# EasyEDA Pro project Project Hail Fally.epro

# Schematic Schematic1
Board Name: Board1; Create Date: 2026-05-25; Page Name: P1; Project Name: Project Hail Fally; Schematic Name: Schematic1; Update Date: 2026-05-28; Company: EasyEDA.com; Page Size: A4; Version: V1.0
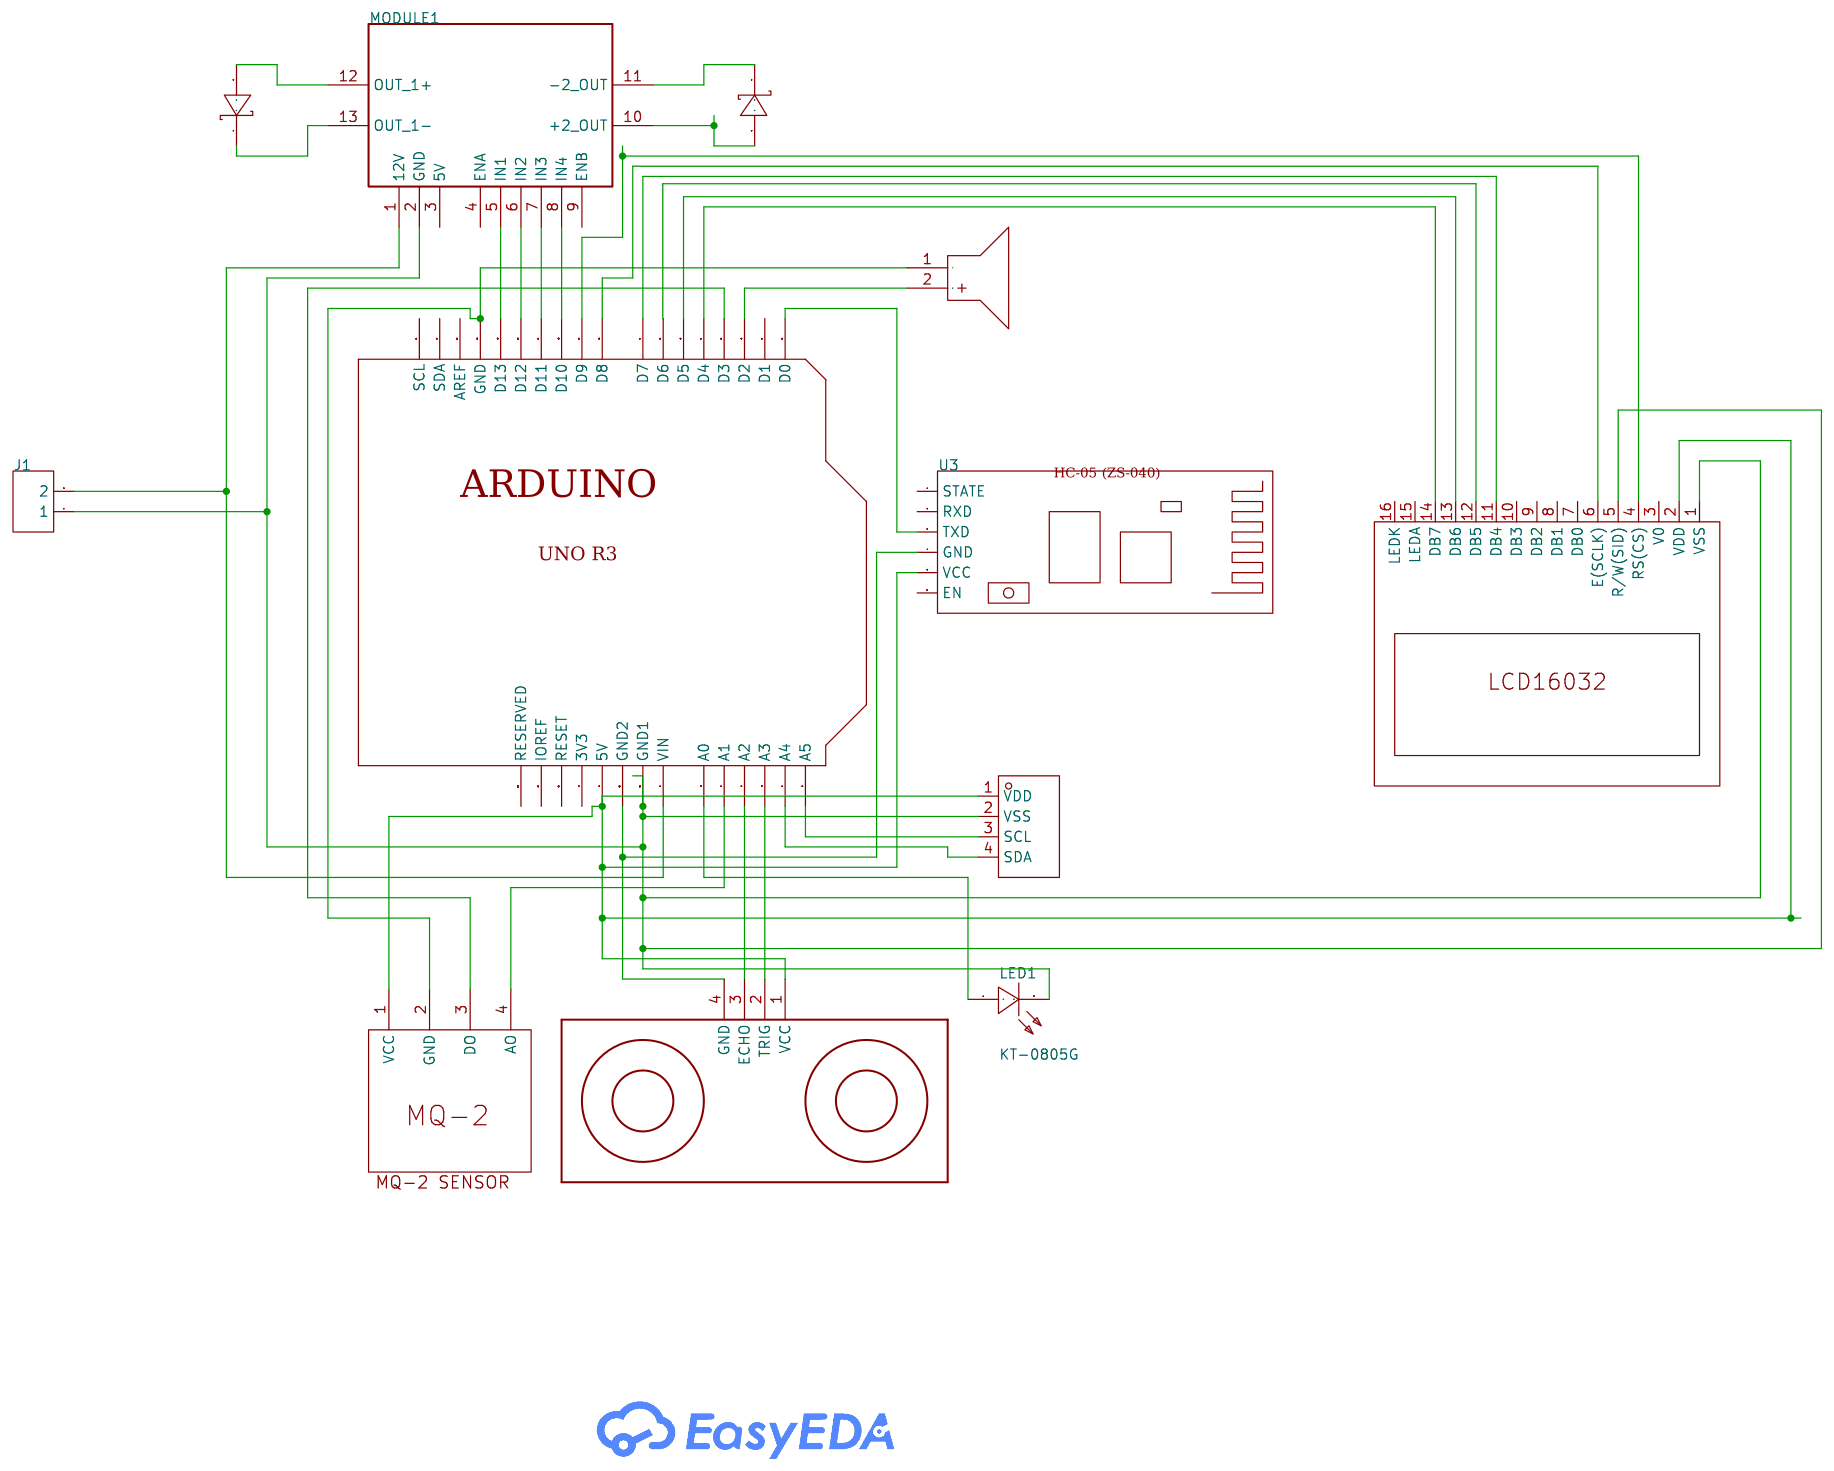
[diagram p0: schematic sheet]

## Parts
BUZZER1  buzzer  [BUZ-TH_BD12.0-P6.00-D0.9-RD]
D1  1N5819WS  [SOD-323_L1.8-W1.3-LS2.5-RD]
D2  1N5819WS  [SOD-323_L1.8-W1.3-LS2.5-RD]
J1  Bettery Connector  [HDR-M-2.54_1X2]
LED1  KT-0805G  [LED0805-R-RD]
MODULE1  L298N DUAL H-BRIDGE MOTOR DRIVER MODULE COPY1  [L298N DUAL H-BRIDGE MOTOR DRIVER MODULE footprint]
S1  Sensor_MQ-2_module_vertical_AIH  [SENSOR_MQ-2_MODULE_VERTICAL_AIH]
U1  SMR16032-ZD  [LCD-TH_SMR16032-ZD]
U2  weklin_ultrasonic_ULTRASONIC-HC-SR04_  [ULTRASONIC-HC-SR04]
U3  HC05-Bluetooth-Module_AK  [hc05-bluetooth-module_ak]
U4  HIH7121-021-001S  [SIP-4_L4.9-W1.9-P1.27-L]
U$1  Arduino Uno  [ARDUINO-R3]

## Library data of the parts
BUZZER1 = BUZZER: Supplier Part: C9900014030; JLCPCB Part Class: Extended Part; Supplier: LCSC
D1 D2 = 1N5819WS_C191023: Voltage - Forward(Vf@If):600mV@1A Voltage - DC Reverse(Vr):40V Current - Rectified:1A Non-Repetitive Peak Forward Surge Current:25A; LCSC Part Name: 电压:40V 电流:1A; Supplier Part: C191023; Manufacturer: Hottech(合科泰); Supplier Footprint: SOD-323; JLCPCB Part Class: Basic Part; Datasheet: https://item.szlcsc.com/datasheet/1N5819WS/213850.html; Supplier: LCSC; Voltage - Forward(Vf@If): 600mV@1A; Voltage - DC Reverse(Vr): 40V; Current - Rectified: 1A; Non-Repetitive Peak Forward Surge Current: 25A
J1 = Bettery Connector
LED1 = KT-0805G: Lamp Holder Type:2mm x 1.25mm square LED Illumination Color:Emerald Green Voltage - Forward(Vf):2.6V~3.1V Voltage - Forward(Vf):2.6V~3.1V Power(Watts):100mW Forward Current:5mA Wavelength - Dominant:513nm~528nm Wavelength - Dominant:513nm~528nm Peak Wavel; LCSC Part Name: 0805 翠绿 高亮; Supplier Part: C2297; Manufacturer: KENTO; Supplier Footprint: 0805; Datasheet: https://item.szlcsc.com/datasheet/KT-0805G/2670.html; Supplier: LCSC; Lamp Holder Type: 2mm x 1.25mm square LED; Illumination Color: Emerald Green; Voltage - Forward(Vf): 2.6V~3.1V; Power(Watts): 100mW; Forward Current: 5mA; Wavelength - Dominant: 513nm~528nm; Peak Wavelength: 525nm; Diode Configuration: Discrete Diode; Lens Color: Water Clear; Luminous Intensity: 430mcd; Viewing Angle: 120°; Operating Temperature: -40℃~+85℃
MODULE1 = L298N DUAL H-BRIDGE MOTOR DRIVER MODULE COPY1
S1 = MQ-2
U1 = SMR16032-ZD: Supplier Part: C9900249207; Supplier Footprint: LCD16032; Supplier: LCSC
U2 = weklin_ultrasonic_ULTRASONIC-HC-SR04_: LIB: weklin_ultrasonic; PRICE: 1,51; MANUFACTURER: Unknow; MPN: HC-SR04; OC_FARNELL: N.A.
U3 = HC05-Bluetooth-Module_AK: Modulo bluetooth
U4 = HIH7121-021-001S: Voltage - Supply:2.3V~5.5V Voltage - Supply:2.3V~5.5V; LCSC Part Name: 湿度：0%RH~100%RH; Supplier Part: C17346099; Manufacturer: Honeywell(霍尼韦尔); Supplier Footprint: SIP-4; Datasheet: https://item.szlcsc.com/datasheet/HIH7121-021-001S/18475263.html; Supplier: LCSC; Voltage - Supply: 2.3V~5.5V
U$1 = Arduino Uno

## Nets
$1N2570: J1.2 MODULE1.1(12V) U$1.VIN
$1N2633: MODULE1.5(IN1) U$1.D13
$1N2642: MODULE1.6(IN2) U$1.D12
$1N2654: MODULE1.7(IN3) U$1.D11
$1N2665: MODULE1.8(IN4) U$1.D10
$1N2669: D1.1(K) MODULE1.11(-2_OUT)
$1N2675: D1.2(A) MODULE1.10(+2_OUT)
$1N2684: D2.2(A) MODULE1.12(OUT_1+)
$1N2691: D2.1(K) MODULE1.13(OUT_1-)
$1N2827: U1.4(RS(CS)) U$1.D9
$1N2966: U1.13(DB6) U$1.D5
$1N2988: U1.14(DB7) U$1.D4
$1N2994: U2.2(TRIG) U$1.A3
$1N3109: U4.3(SCL) U$1.A5
$1N3118: U4.4(SDA) U$1.A4
$1N3220: BUZZER1.2(+) U$1.D2
$1N3505: U3.3(TXD) U$1.D0
$1N3594: U1.11(DB4) U$1.D7
$1N3613: U1.6(E(SCLK)) U$1.D8
$1N3669: U2.3(ECHO) U$1.A2
$1N4283: U2.4(GND) U3.4(GND) U$1.GND2
$1N4424: S1.1(VCC) U1.2(VDD) U2.1(VCC) U3.5(VCC) U4.1(VDD) U$1.5V
$1N4727: BUZZER1.1(-) S1.2(GND) U$1.GND
$1N4823: J1.1 LED1.2(K) MODULE1.2(GND) U1.1(VSS) U1.5(R/W(SID)) U4.2(VSS) U$1.GND1
$1N4998: S1.4(AO) U$1.A1
$1N5007: S1.3(DO) U$1.D3
$1N5154: LED1.1(A) U$1.A0

Not connected (* = marked no-connect by the designer): MODULE1 3(5V) 4(ENA) 9(ENB); U1 3(V0) 7(DB0) 8(DB1) 9(DB2) 10(DB3) 12(DB5) 15(LEDA) 16(LEDK); U3 1(STATE) 2(RXD) 6(EN); U$1 3V(3V3) AREF D1 D6 IOREF RESERVED RESET SCL SDA

# Board PCB1
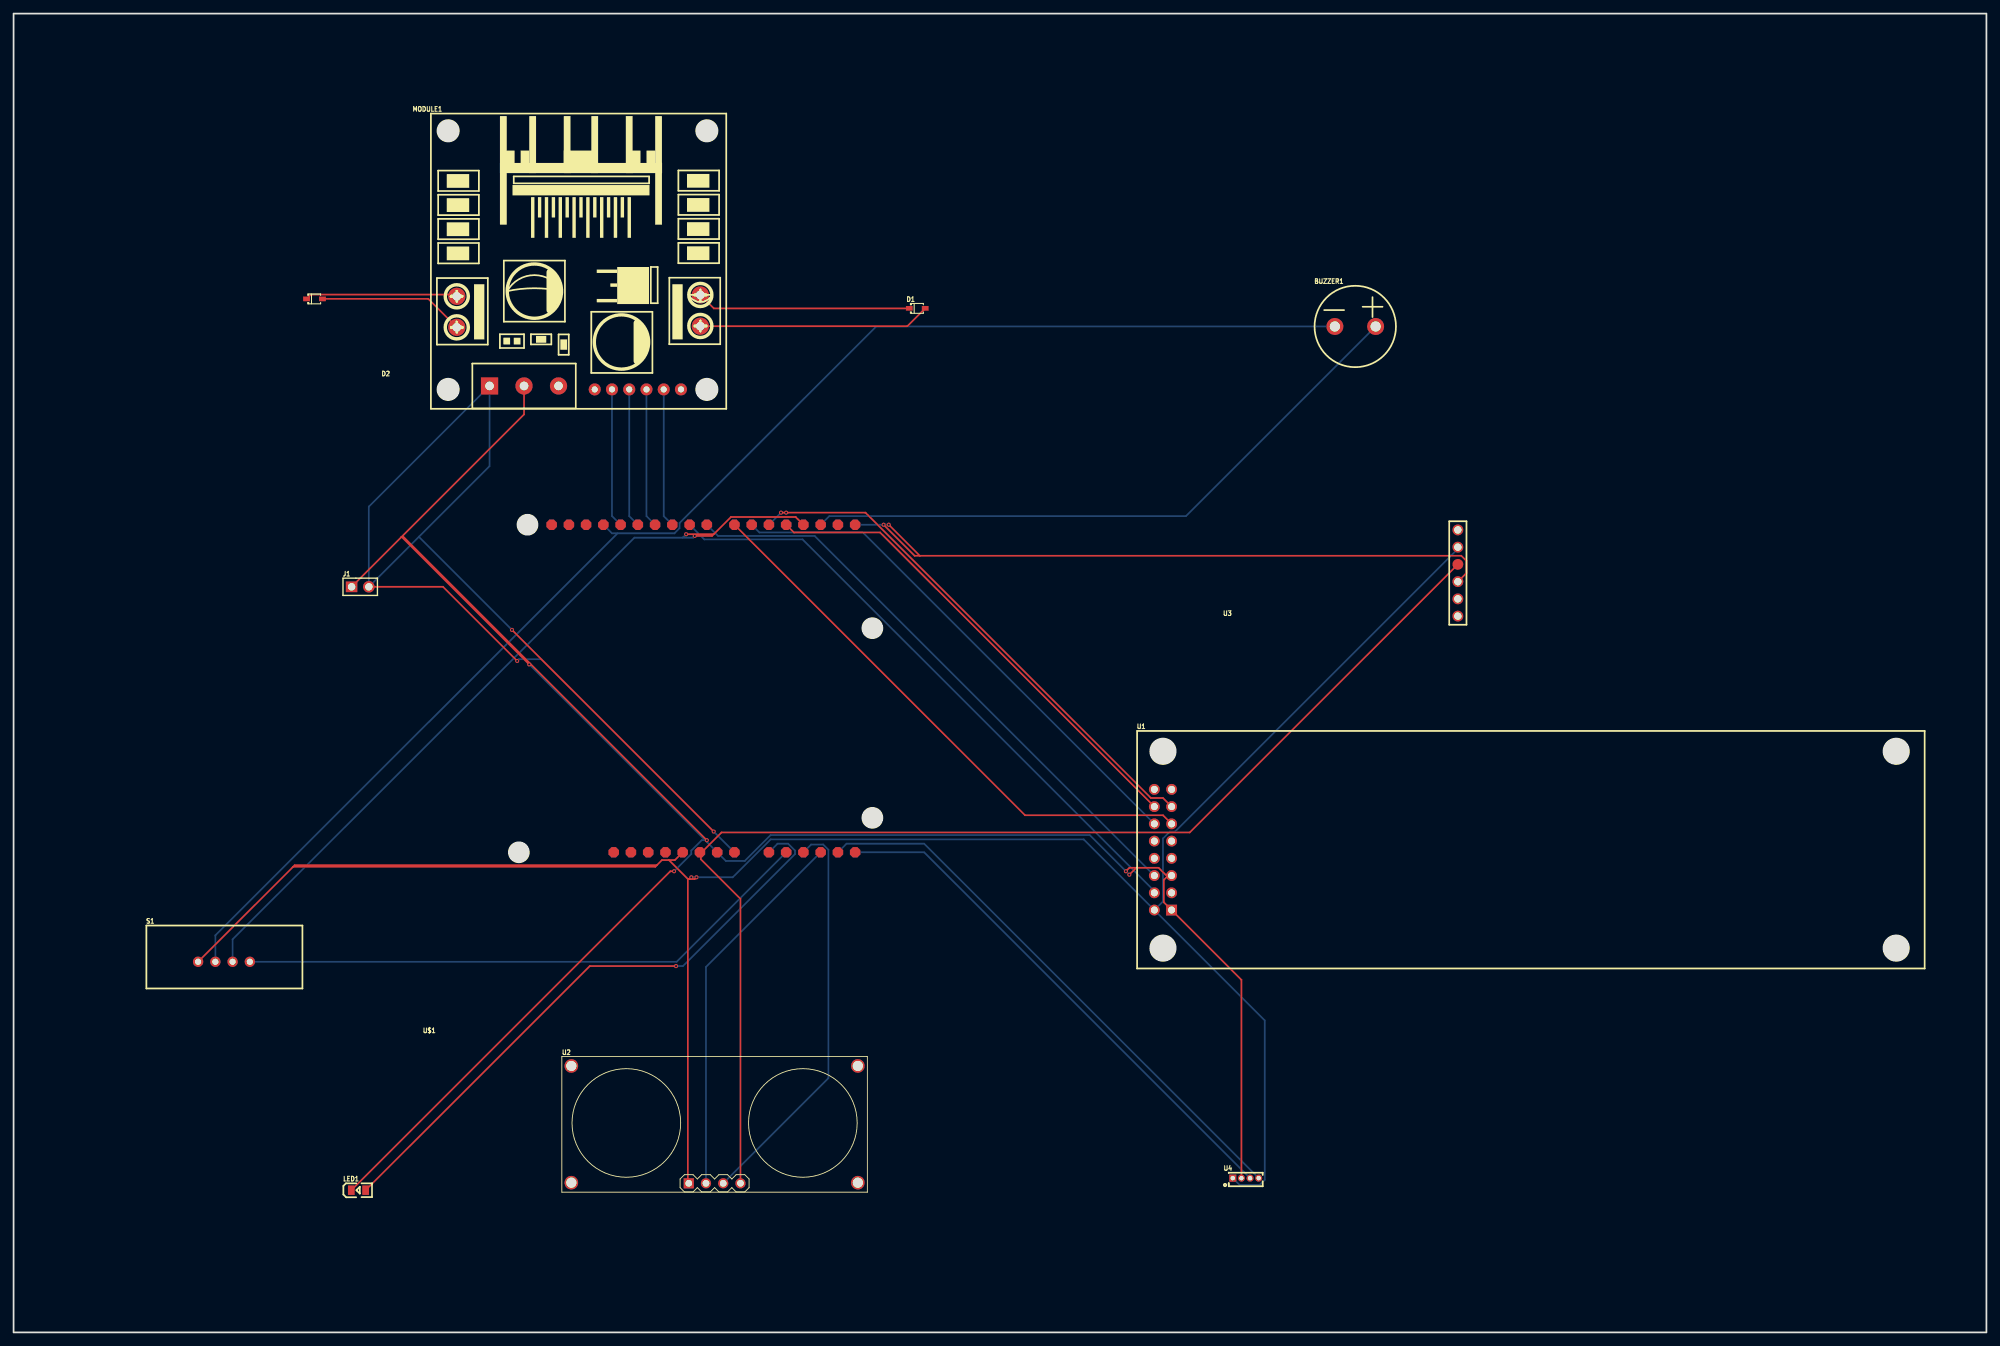
[diagram p1: board, top side]
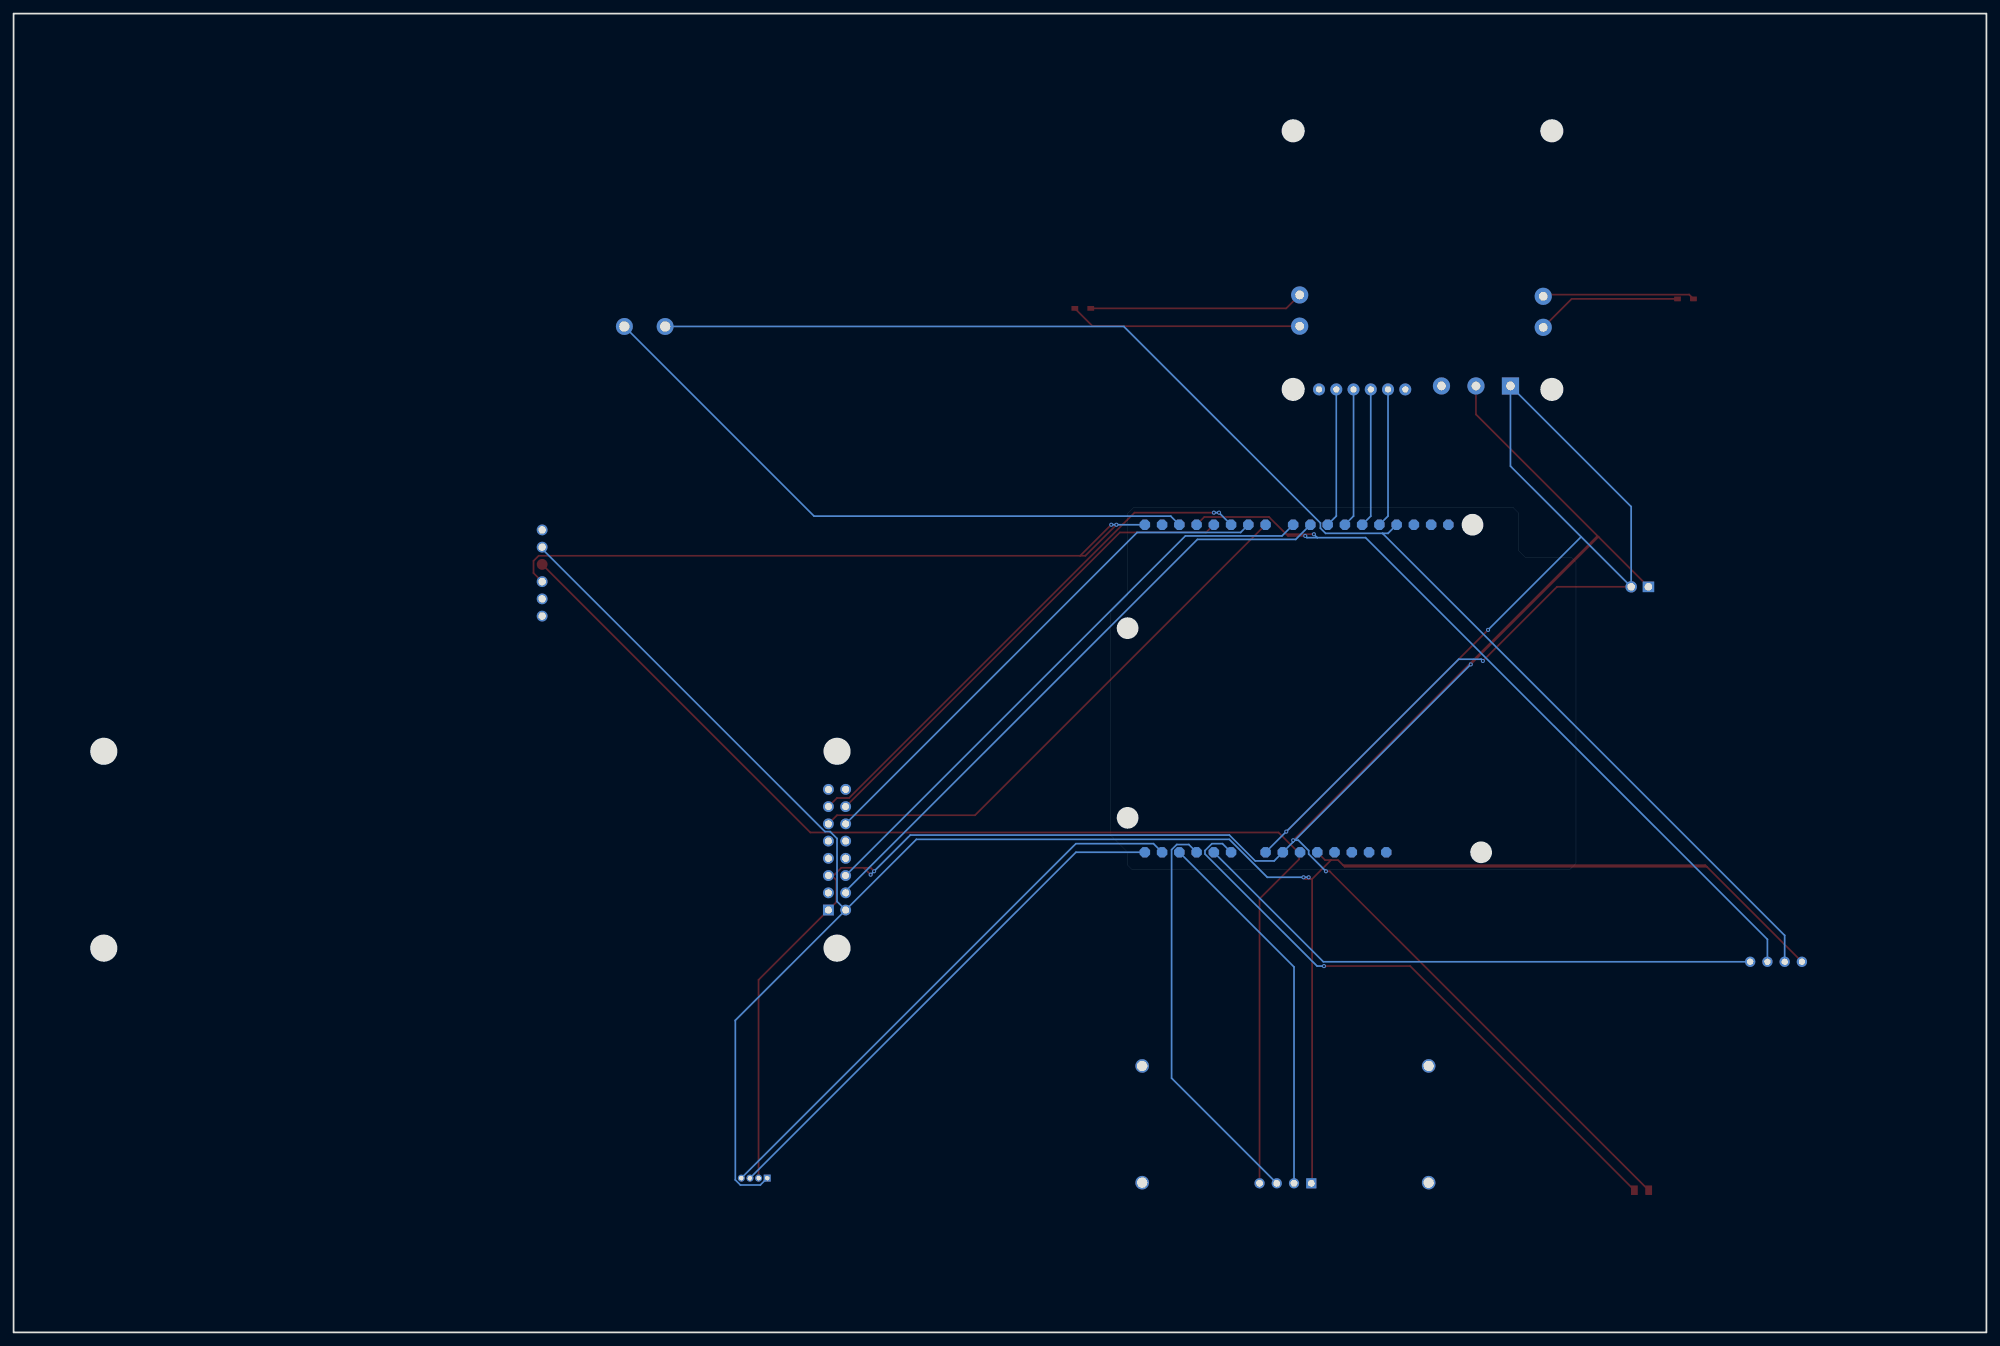
[diagram p2: board, bottom side, seen from below]

Outline 290.58 x 194.31 mm; copper layers: Top Layer, Bottom Layer. Coordinates in mm from the lower left corner of the outline.
Outline path: rectangle 0,194.31 290.58,0
Stack: Top Layer 0.035mm / Dielectric1 1.51mm FR4 er 4.5 / Bottom Layer 0.035mm

## Design rules (mm)
template: JLCPCB Capability(Two Layers Board)
spacing copperThickness1oz (default): track to track 0.102, other pairs 0.152 to 0.3
spacing copperThickness2oz: track to track 0.203, other pairs 0.152 to 0.3
track width copperThickness1oz (default): min 0.127, default 0.254, max 2.54
track width copperThickness2oz: min 0.203, default 0.254, max 2.54
differential pair differentialPair (default): width min 0.127, default 0.254, max 2.54; gap min 0.152, default 0.152
via viaSize (default): diameter min 0.5, default 0.61, max 10; hole min 0.3, default 0.305, max 6.3

## Placement (name value [footprint] x y rotation side)
BUZZER1  buzzer  [BUZ-TH_BD12.0-P6.00-D0.9-RD]  197.61 148.21 0 top
D1  1N5819WS  [SOD-323_L1.8-W1.3-LS2.5-RD]  133.1 150.88 0 top
D2  1N5819WS  [SOD-323_L1.8-W1.3-LS2.5-RD]  44.32 152.27 0 top
J1  Bettery Connector  [HDR-M-2.54_1X2]  51.05 109.86 0 top
LED1  KT-0805G  [LED0805-R-RD]  50.8 20.96 0 top
MODULE1  L298N DUAL H-BRIDGE MOTOR DRIVER MODULE COPY1  [L298N DUAL H-BRIDGE MOTOR DRIVER MODULE footprint]  85.6 138.94 0 top
S1  Sensor_MQ-2_module_vertical_AIH  [SENSOR_MQ-2_MODULE_VERTICAL_AIH]  30.99 54.61 0 top
U1  SMR16032-ZD  [LCD-TH_SMR16032-ZD]  169.29 71.12 0 top
U2  weklin_ultrasonic_ULTRASONIC-HC-SR04_  [ULTRASONIC-HC-SR04]  103.25 30.86 0 top
U3  HC05-Bluetooth-Module_AK  [hc05-bluetooth-module_ak]  212.72 118.24 0 top
U4  HIH7121-021-001S  [SIP-4_L4.9-W1.9-P1.27-L]  181.48 22.73 0 top
U$1  Arduino Uno  [ARDUINO-R3]  60.45 68.2 0 top

## Footprints (pads in the part's own frame, mm; a bottom-side part is the same pattern mirrored in y, then rotated)
ARDUINO-R3
  custom 1.549x1.549 hole 1: 3V(35.56,2.54) 5V(38.1,2.54) A0(50.8,2.54) A1(53.34,2.54) A2(55.88,2.54) A3(58.42,2.54) A4(60.96,2.54) A5(63.499,2.54) AREF(23.876,50.8) D0(63.499,50.8) D1(60.96,50.8) D2(58.42,50.8) D3(55.88,50.8) D4(53.34,50.8) D5(50.8,50.8) D6(48.26,50.8) D7(45.72,50.8) D8(41.656,50.8) D9(39.116,50.8) D10(36.576,50.8) D11(34.036,50.8) D12(31.496,50.8) D13(28.956,50.8) GND(26.416,50.8) GND1(43.18,2.54) GND2(40.64,2.54) IOREF(30.48,2.54) RESERVED(27.94,2.54) RESET(33.02,2.54) SCL(18.796,50.8) SDA(21.336,50.8) VIN(45.72,2.54)
BUZ-TH_BD12.0-P6.00-D0.9-RD
  round 2.5 hole 1.5: 1(-3,0) 2(3,0)
hc05-bluetooth-module_ak
  round 1.6 hole 1.092: 1(0,-12.7) 2(0,-10.16) 3(0,-7.62) 5(0,-2.54) 6(0,0)
  round 1.6 smd: 4(0,-5.08)
HDR-M-2.54_1X2
  rect 1.7x1.575 hole 1.1: 1(-1.27,0)
  round 1.7 hole 1.1: 2(1.27,0)
L298N DUAL H-BRIDGE MOTOR DRIVER MODULE footprint
  rect 2.54x2.54 hole 1.27: 1(-15.494,0.508)
  round 2.54 hole 1.27: 2(-10.414,0.508) 3(-5.334,0.508) 10(15.554,9.316) 11(15.554,13.917) 12(-20.32,9.144) 13(-20.32,13.716)
  round 1.778 hole 0.914: 4(0,0) 5(2.54,0) 6(5.08,0) 7(7.62,0) 8(10.16,0) 9(12.7,0)
LCD-TH_SMR16032-ZD
  rect 1.6x1.6 hole 1.05: 1(1.27,-8.89)
  round 1.6 hole 1.05: 2(-1.27,-8.89) 3(1.27,-6.35) 4(-1.27,-6.35) 5(1.27,-3.81) 6(-1.27,-3.81) 7(1.27,-1.27) 8(-1.27,-1.27) 9(1.27,1.27) 10(-1.27,1.27) 11(1.27,3.81) 12(-1.27,3.81) 13(1.27,6.35) 14(-1.27,6.35) 15(1.27,8.89) 16(-1.27,8.89)
LED0805-R-RD
  rect 1x1.399 smd: 1(1.05,0) 2(-1.05,0)
SENSOR_MQ-2_MODULE_VERTICAL_AIH
  round 1.524 hole 0.914: 1(-3.81,0) 2(-1.27,0) 3(1.27,0) 4(3.81,0)
SIP-4_L4.9-W1.9-P1.27-L
  rect 1.05x1.05 hole 0.65: 1(-1.905,0)
  round 1.05 hole 0.65: 2(-0.635,0) 3(0.635,0) 4(1.905,0)
SOD-323_L1.8-W1.3-LS2.5-RD
  rect 1x0.7 smd: 1(-1.173,0) 2(1.173,0)
ULTRASONIC-HC-SR04
  rect 1.508x1.508 hole 1: 1(-3.81,-8.89)
  round 1.508 hole 1: 2(-1.27,-8.89) 3(1.27,-8.89) 4(3.81,-8.89)
  round 2.008 hole 1.5: P$1(-21.1,8.4) P$2(21.1,8.4) P$3(21.1,-8.8) P$4(-21.1,-8.8)

## Nets
As in the schematic, except:
$1N2932: U1.12 U$1.D6

Pads without a net: MODULE1 3 4 9; U1 3 7 8 9 10 15 16; U2 P$1 P$2 P$3 P$4; U3 1 2 6; U$1 3V AREF D1 IOREF RESERVED RESET SCL SDA

## Via types
v1: diameter 0.61, hole 0.305, Top Layer to Bottom Layer, 17 vias

## Routing (per net, layer and track width the routed paths; a pad name or vN(x,y) marks a point on that pad's centre or on a via; arc(x,y) is an arc through that point)
$1N2570: length 205.6
  Top Layer w0.254: v1(73.41,103.5) v1(103.12,73.79) ; J1.2 63.25,109.86 v1(74.17,98.93)
  Bottom Layer w0.254: 59.69,117.22 J1.2 52.32,121.67 MODULE1.1 70.1,127.64 59.69,117.22 ; 59.69,117.22 v1(73.41,103.5) ; v1(74.17,98.93) 74.42,99.19 77.72,99.19 v1(103.12,73.79) U$1.VIN
$1N2633: length 20.5
  Bottom Layer w0.254: MODULE1.5 88.14,120.27 89.41,119
$1N2642: length 20.5
  Bottom Layer w0.254: 91.95,119 90.68,120.27 MODULE1.6
$1N2654: length 20.5
  Bottom Layer w0.254: MODULE1.7 93.22,120.27 94.49,119
$1N2665: length 20.5
  Bottom Layer w0.254: 97.03,119 95.76,120.27 MODULE1.8
$1N2669: length 31.6
  Top Layer w0.254: MODULE1.11 103.13,150.88 D1.1
$1N2675: length 34.2
  Top Layer w0.254: MODULE1.10 131.65,148.25 D1.2
$1N2684: length 21.5
  Top Layer w0.254: MODULE1.12 61.09,152.27 D2.2
$1N2691: length 22.5
  Top Layer w0.254: D2.1 43.79,152.91 65.02,152.91 MODULE1.13
$1N2827: length 91.1
  Bottom Layer w0.254: 99.57,119 101.73,116.84 116.2,116.84 168.02,65.02 168.02,64.77
$1N2932: length 77.6
  Bottom Layer w0.254: 168.02,74.93 125.09,117.86 109.85,117.86 108.71,119
$1N2966: length 78.7
  Top Layer w0.254: U1.13 169.29,78.74 167.51,78.74 125.48,120.78 v1(113.79,120.78) v1(113.03,120.78)
  Bottom Layer w0.254: 111.25,119 v1(113.03,120.78) v1(113.79,120.78)
$1N2988: length 71.4
  Top Layer w0.254: 113.79,119 114.93,117.86 127.64,117.86 168.02,77.47
$1N2994: length 55.8
  Bottom Layer w0.254: U2.2 101.98,53.85 U$1.A3
$1N3109: length 78.1
  Bottom Layer w0.254: U4.3 134.11,70.74 U$1.A5
$1N3118: length 82.9
  Bottom Layer w0.254: U$1.A4 122.68,72.01 134.11,72.01 U4.4
$1N3220: length 93.8
  Bottom Layer w0.254: BUZZER1.2 172.67,120.27 120.14,120.27 118.87,119
$1N3505: length 103.1
  Top Layer w0.254: 212.72,110.62 214,111.89 214,113.67 213.23,114.43 133.48,114.43 ; 133.48,114.43 v1(128.91,119) ; 133.48,114.43 132.72,114.43 v1(128.14,119)
  Bottom Layer w0.254: v1(128.91,119) v1(128.14,119) 123.95,119
$1N3594: length 82.6
  Top Layer w0.254: U1.11 169.29,76.2 148.97,76.2 106.17,119
$1N3613: length 87.3
  Bottom Layer w0.254: 168.02,67.31 117.98,117.35 103.76,117.35 102.11,119
$1N3669: length 60
  Bottom Layer w0.254: 104.52,21.97 120.02,37.47 120.02,71.12 119.25,71.88 117.47,71.88 U$1.A2
$1N4283: length 180.4
  Top Layer w0.254: U3.4 173.23,73.66 104.27,73.66 101.22,70.61 ; 101.22,70.61 101.22,69.72 107.06,63.88 U2.4 ; 101.22,70.61 U$1.GND2
$1N4424: length 381.5
  Top Layer w0.254: U$1.5V 97.41,69.6 96.52,69.6 ; 41.17,68.61 41.4,68.83 94.74,68.83 ; 41.17,68.61 S1.1 ; 41.17,68.61 94.51,68.61 94.74,68.83 ; v1(100.58,67.06) 100.33,66.8 99.57,66.8 ; 94.74,68.83 95.5,69.6 96.52,69.6 ; 96.52,69.6 99.31,66.8 ; 99.31,66.8 99.31,22.1 U2.1 ; 99.31,66.8 99.57,66.8 ; 99.57,66.8 v1(99.82,67.06)
  Bottom Layer w0.254: U4.1 180.59,21.72 183.52,21.72 184.28,22.48 184.28,45.97 168.02,62.23 ; 168.02,62.23 157.61,72.64 111.51,72.64 105.92,67.06 v1(100.58,67.06) v1(99.82,67.06) ; 168.02,62.23 169.29,63.5 169.29,72.77 170.31,73.79 171.07,73.79 212.72,115.44 212.72,115.7
$1N4727: length 209
  Bottom Layer w0.254: 88.95,117.73 97.33,117.73 98.09,118.49 98.09,119.25 127.05,148.21 BUZZER1.1 ; 88.95,117.73 88.14,117.73 86.87,119 ; 88.95,117.73 29.72,58.5 S1.2
$1N4823: length 367.4
  Top Layer w0.254: 165.35,68.45 164.34,68.45 v1(163.83,67.94) ; 165.35,68.45 168.66,68.45 169.67,67.44 170.18,67.44 ; 165.35,68.45 v1(164.34,67.44) ; LED1.2 96.74,67.94 v1(97.28,67.94) ; v1(102.11,72.52) 57.4,117.22 57.15,117.22 ; U1.5 170.43,67.44 170.18,67.44 ; 170.18,67.44 169.42,66.68 169.42,63.37 U1.1 180.85,51.94 U4.2 ; J1.1 57.15,117.22 ; 57.15,117.22 v1(75.95,98.42) ; 57.15,117.22 75.18,135.25 MODULE1.2
  Bottom Layer w0.254: v1(97.28,67.94) 99.82,70.49 99.82,70.99 101.35,72.52 101.85,72.52 ; 101.85,72.52 102.11,72.26 ; 101.85,72.52 v1(102.11,72.52) 102.11,72.26 ; 101.85,72.52 v1(75.95,98.42) ; 102.11,72.26 U$1.GND1 104.9,69.47 107.7,69.47 111.51,73.28 158.5,73.28 v1(163.83,67.94) v1(164.34,67.44)
$1N4998: length 85.7
  Bottom Layer w0.254: U$1.A1 97.66,54.61 S1.4
$1N5007: length 118.4
  Top Layer w0.254: 103.12,117.6 102.87,117.35 v1(100.33,117.35) ; 103.12,117.6 105.66,120.14 115.19,120.14 116.33,119 ; 103.12,117.6 v1(99.06,117.6)
  Bottom Layer w0.254: 98.55,117.09 v1(99.06,117.6) ; 98.55,117.09 100.08,117.09 v1(100.33,117.35) ; 98.55,117.09 91.44,117.09 32.26,57.91 S1.3
$1N5154: length 89.1
  Top Layer w0.254: LED1.1 84.87,53.97 v1(97.57,53.97)
  Bottom Layer w0.254: U$1.A0 112.52,72.01 114.08,72.01 115.1,70.99 115.1,70.49 98.59,53.97 v1(97.57,53.97)
